# EAGLE schematic BeagleBone_Black_Rev C EAGLE PCB (EAGLE 7.2.0), part 2 of 2
## Sheet 9 of 11
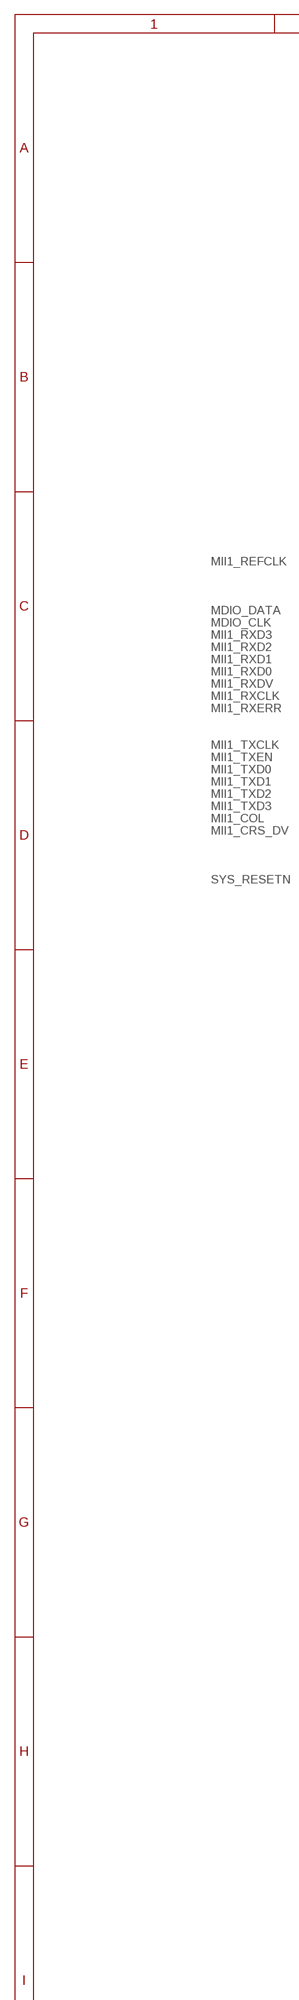
[diagram p14: schematic, sheet 9, part 1 of 2]
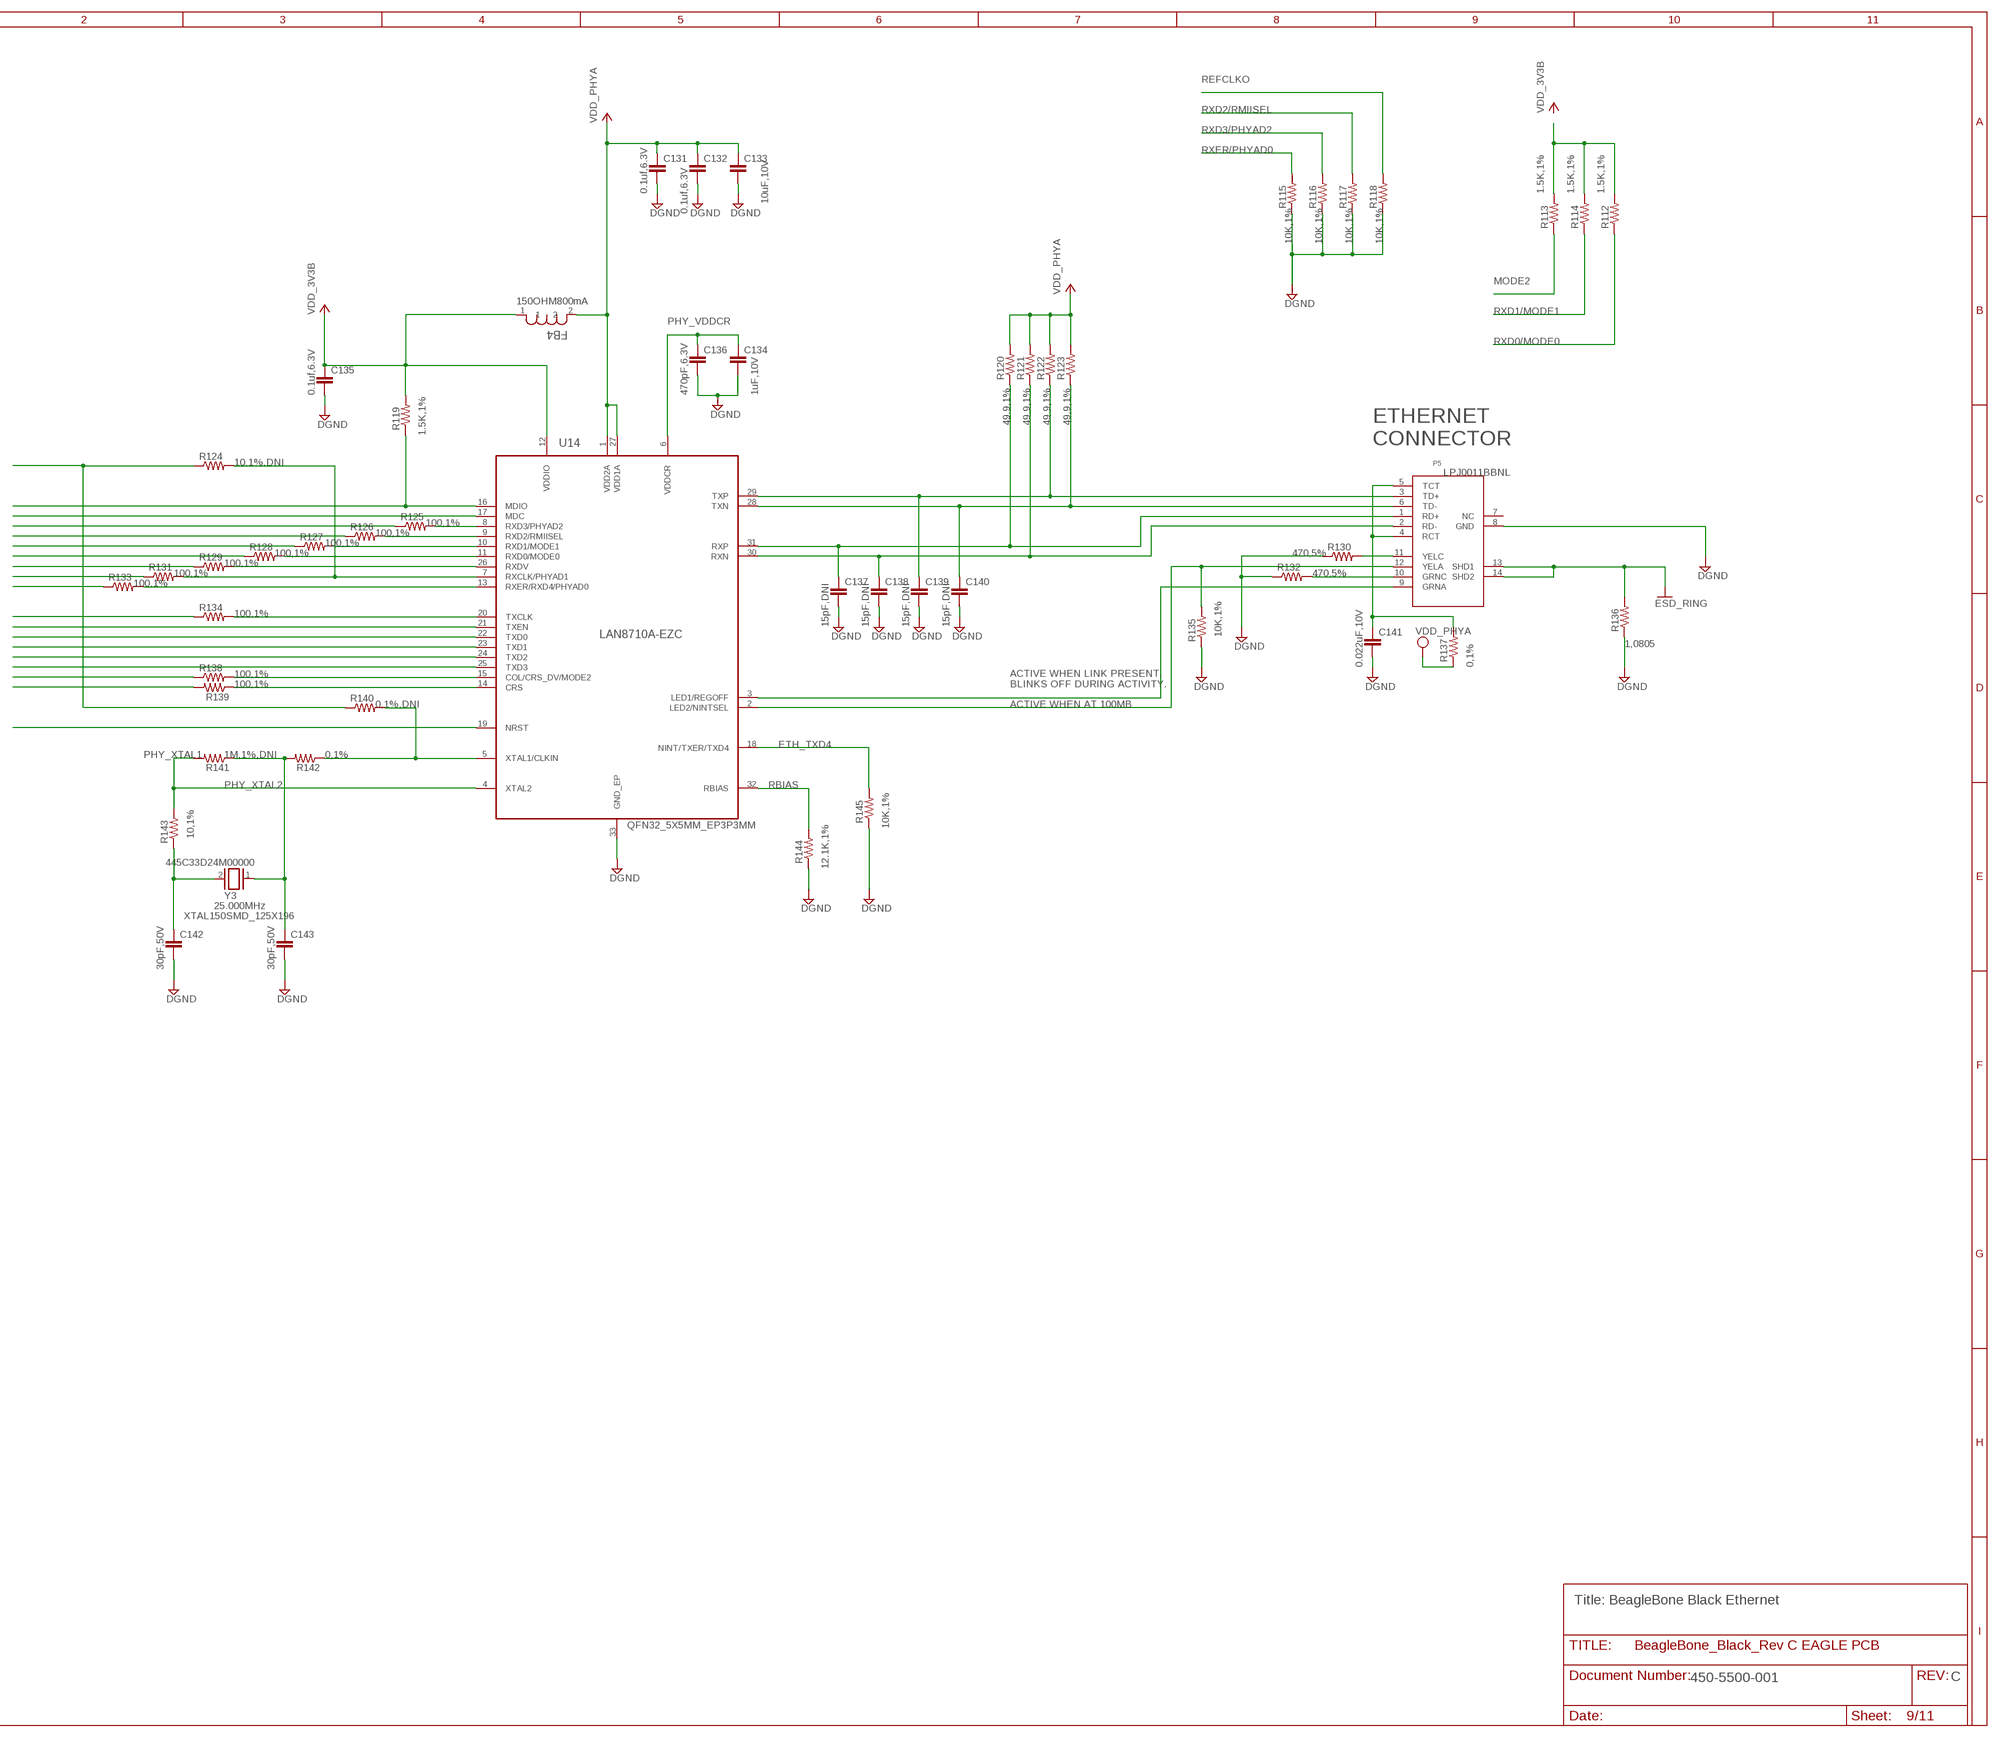
[diagram p15: schematic, sheet 9, part 2 of 2]

### Parts
C131  C-EUC0402  [C0402]
C132  C-EUC0402  [C0402]
C133  C-EUC0402  [C0402]
C134  C-EUC0402  [C0402]
C135  C-EUC0402  [C0402]
C136  C-EUC0402  [C0402]
C137  C-EUC0402  [C0402]
C138  C-EUC0402  [C0402]
C139  C-EUC0402  [C0402]
C140  C-EUC0402  [C0402]
C141  C-EUC0402  [C0402]
C142  C-EUC0402  [C0402]
C143  C-EUC0402  [C0402]
FB4  PM0805-68NK-RC  [INDC2115X15N]
P5  LPJ0011BBNL  [LPJ0011BBNL]
R112  R-US_R0402  [R0402]
R113  R-US_R0402  [R0402]
R114  R-US_R0402  [R0402]
R115  R-US_R0402  [R0402]
R116  R-US_R0402  [R0402]
R117  R-US_R0402  [R0402]
R118  R-US_R0402  [R0402]
R119  R-US_R0402  [R0402]
R120  R-US_R0402  [R0402]
R121  R-US_R0402  [R0402]
R122  R-US_R0402  [R0402]
R123  R-US_R0402  [R0402]
R124  R-US_R0402  [R0402]
R125  R-US_R0402  [R0402]
R126  R-US_R0402  [R0402]
R127  R-US_R0402  [R0402]
R128  R-US_R0402  [R0402]
R129  R-US_R0402  [R0402]
R130  R-US_R0402  [R0402]
R131  R-US_R0402  [R0402]
R132  R-US_R0402  [R0402]
R133  R-US_R0402  [R0402]
R134  R-US_R0402  [R0402]
R135  R-US_R0402  [R0402]
R136  R-US_R0402  [R0402]
R137  R-US_R0402  [R0402]
R138  R-US_R0402  [R0402]
R139  R-US_R0402  [R0402]
R140  R-US_R0402  [R0402]
R141  R-US_R0402  [R0402]
R142  R-US_R0402  [R0402]
R143  R-US_R0402  [R0402]
R144  R-US_R0402  [R0402]
R145  R-US_R0402  [R0402]
U14  LAN8710A-EZC  [QFN50P500X500X100-33N]
Y3  445C33D24M00000  [445C33D24M00000]

### Nets
GND: C131.2 C132.2 C133.2 C134.2 C135.2 C136.2 C137.2 C138.2 C139.2 C140.2 C141.2 C142.2 C143.2 P5.8(GND) P5.13(SHD1) P5.14(SHD2) R115.1 R116.1 R117.1 R118.1 R130.1 R132.1 R135.1 R136.1 R136.2 R144.1 R145.1 U14.33(GND_EP) ; supply symbol labelled DGND, ESD_RING ; also sheet 2,3,4,5,6,7,8,10,11
MDIO_CLK: U14.17(MDC) ; also sheet 4
MDIO_DATA: R119.1 U14.16(MDIO) ; also sheet 4
MII1_COL: R138.1 ; also sheet 4
MII1_CRS_DV: R139.2 ; also sheet 4
MII1_REFCLK: R124.1 R140.1 ; also sheet 4
MII1_RXCLK: R131.1 ; also sheet 4
MII1_RXD0: R128.1 ; also sheet 4
MII1_RXD1: R127.1 ; also sheet 4
MII1_RXD2: R126.1 ; also sheet 4
MII1_RXD3: R125.1 ; also sheet 4
MII1_RXDV: R129.1 ; also sheet 4
MII1_RXERR: R133.1 ; also sheet 4
MII1_TXCLK: R134.1 ; also sheet 4
MII1_TXD0: U14.22(TXD0) ; also sheet 4
MII1_TXD1: U14.23(TXD1) ; also sheet 4
MII1_TXD2: U14.24(TXD2) ; also sheet 4
MII1_TXD3: U14.25(TXD3) ; also sheet 4
MII1_TXEN: U14.21(TXEN) ; also sheet 4
N$292: C142.1 R143.1 Y3.2
N$296: C143.1 R141.1 R142.2 Y3.1
N$299: R140.2 R142.1 U14.5(XTAL1/CLKIN)
N$300: R141.2 R143.2 U14.4(XTAL2)
N$301: R139.1 U14.14(CRS)
N$302: R138.2 U14.15(COL/CRS_DV/MODE2)
N$310: R134.2 U14.20(TXCLK)
N$312: R133.2 U14.13(RXER/RXD4/PHYAD0)
N$315: R124.2 R131.2 U14.7(RXCLK/PHYAD1)
N$316: R129.2 U14.26(RXDV)
N$318: R128.2 U14.11(RXD0/MODE0)
N$320: R127.2 U14.10(RXD1/MODE1)
N$322: R126.2 U14.9(RXD2/RMIISEL)
N$325: R125.2 U14.8(RXD3/PHYAD2)
N$329: C134.1 C136.1 U14.6(VDDCR)
N$330: R144.2 U14.32(RBIAS)
N$331: R145.2 U14.18(NINT/TXER/TXD4)
N$332: C139.1 P5.3(TD+) R122.1 U14.29(TXP)
N$333: C140.1 R123.1 U14.28(TXN)
N$334: C137.1 P5.1(RD+) R120.1 U14.31(RXP)
N$335: C138.1 P5.2(RD-) R121.1 U14.30(RXN)
N$336: R112.2 R113.2 R114.2
N$337: P5.9(GRNA) U14.3(LED1/REGOFF)
N$338: R115.2
N$339: P5.12(YELA) R135.2
N$340: P5.11(YELC) R130.2
N$341: P5.10(GRNC) R132.2
N$342: C141.1 P5.4(RCT) P5.5(TCT) R137.2
N$343: R116.2
N$344: R117.2
N$345: R118.2
N$346: R113.1
N$347: R114.1
N$348: R112.1
SYS_RESETN: U14.19(NRST) ; also sheet 3,11
VCC: C131.1 C132.1 C133.1 C135.1 FB4.1 FB4.2 R119.2 R120.2 R121.2 R122.2 R123.2 R137.1 U14.1(VDD2A) U14.12(VDDIO) U14.27(VDD1A) ; supply symbol labelled VDD_3V3B, VDD_PHYA ; also sheet 2,3,4,5,6,7,8,10,11
Unconnected: P5.6(TD-) P5.7(NC) U14.2(LED2/NINTSEL)

### Notes on the sheet
- REFCLKO
- RXD2/RMIISEL
- RXD3/PHYAD2
- RXER/PHYAD0
- 0.1uf,6.3V | 1.5K,1% | 1.5K,1% | 1.5K,1%
- 10uF,10V
- 0.1uf,6.3V
- 10K,1% | 10K,1% | 10K,1% | 10K,1%
- MODE2
- 150OHM800mA
- RXD1/MODE1
- PHY_VDDCR
- RXD0/MODE0
- 0.1uf,6.3V | 470pF,6.3V | 1uF,10V
- 49.9,1% | 49.9,1% | 49.9,1% | 49.9,1%
- 1.5K,1%
- ETHERNET
  CONNECTOR
- 10,1%,DNI
- LPJ0011BBNL
- 100,1%
- 100,1%
- 100,1%
- 100,1% | 470,5%
- 100,1%
- 100,1% | 470,5%
- 100,1%
- 100,1%
- 15pF,DNI | 15pF,DNI | 15pF,DNI | 15pF,DNI
- 10K,1%
- 1,0805
- 0.022uF,10V | 0,1%
- 100,1%
- 100,1%
- ACTIVE WHEN LINK PRESENT.
  BLINKS OFF DURING ACTIVITY.
- 0,1%,DNI | ACTIVE WHEN AT 100MB
- ETH_TXD4
- PHY_XTAL1 | 1M,1%,DNI | 0,1%
- PHY_XTAL2 | RBIAS
- QFN32_5X5MM_EP3P3MM | 10K,1%
- 10,1%
- 12.1K,1%
- Y3
- 25.000MHz
- XTAL150SMD_125X196
- 30pF,50V | 30pF,50V
- Title: BeagleBone Black Ethernet
- 450-5500-001 | C

## Sheet 10 of 11
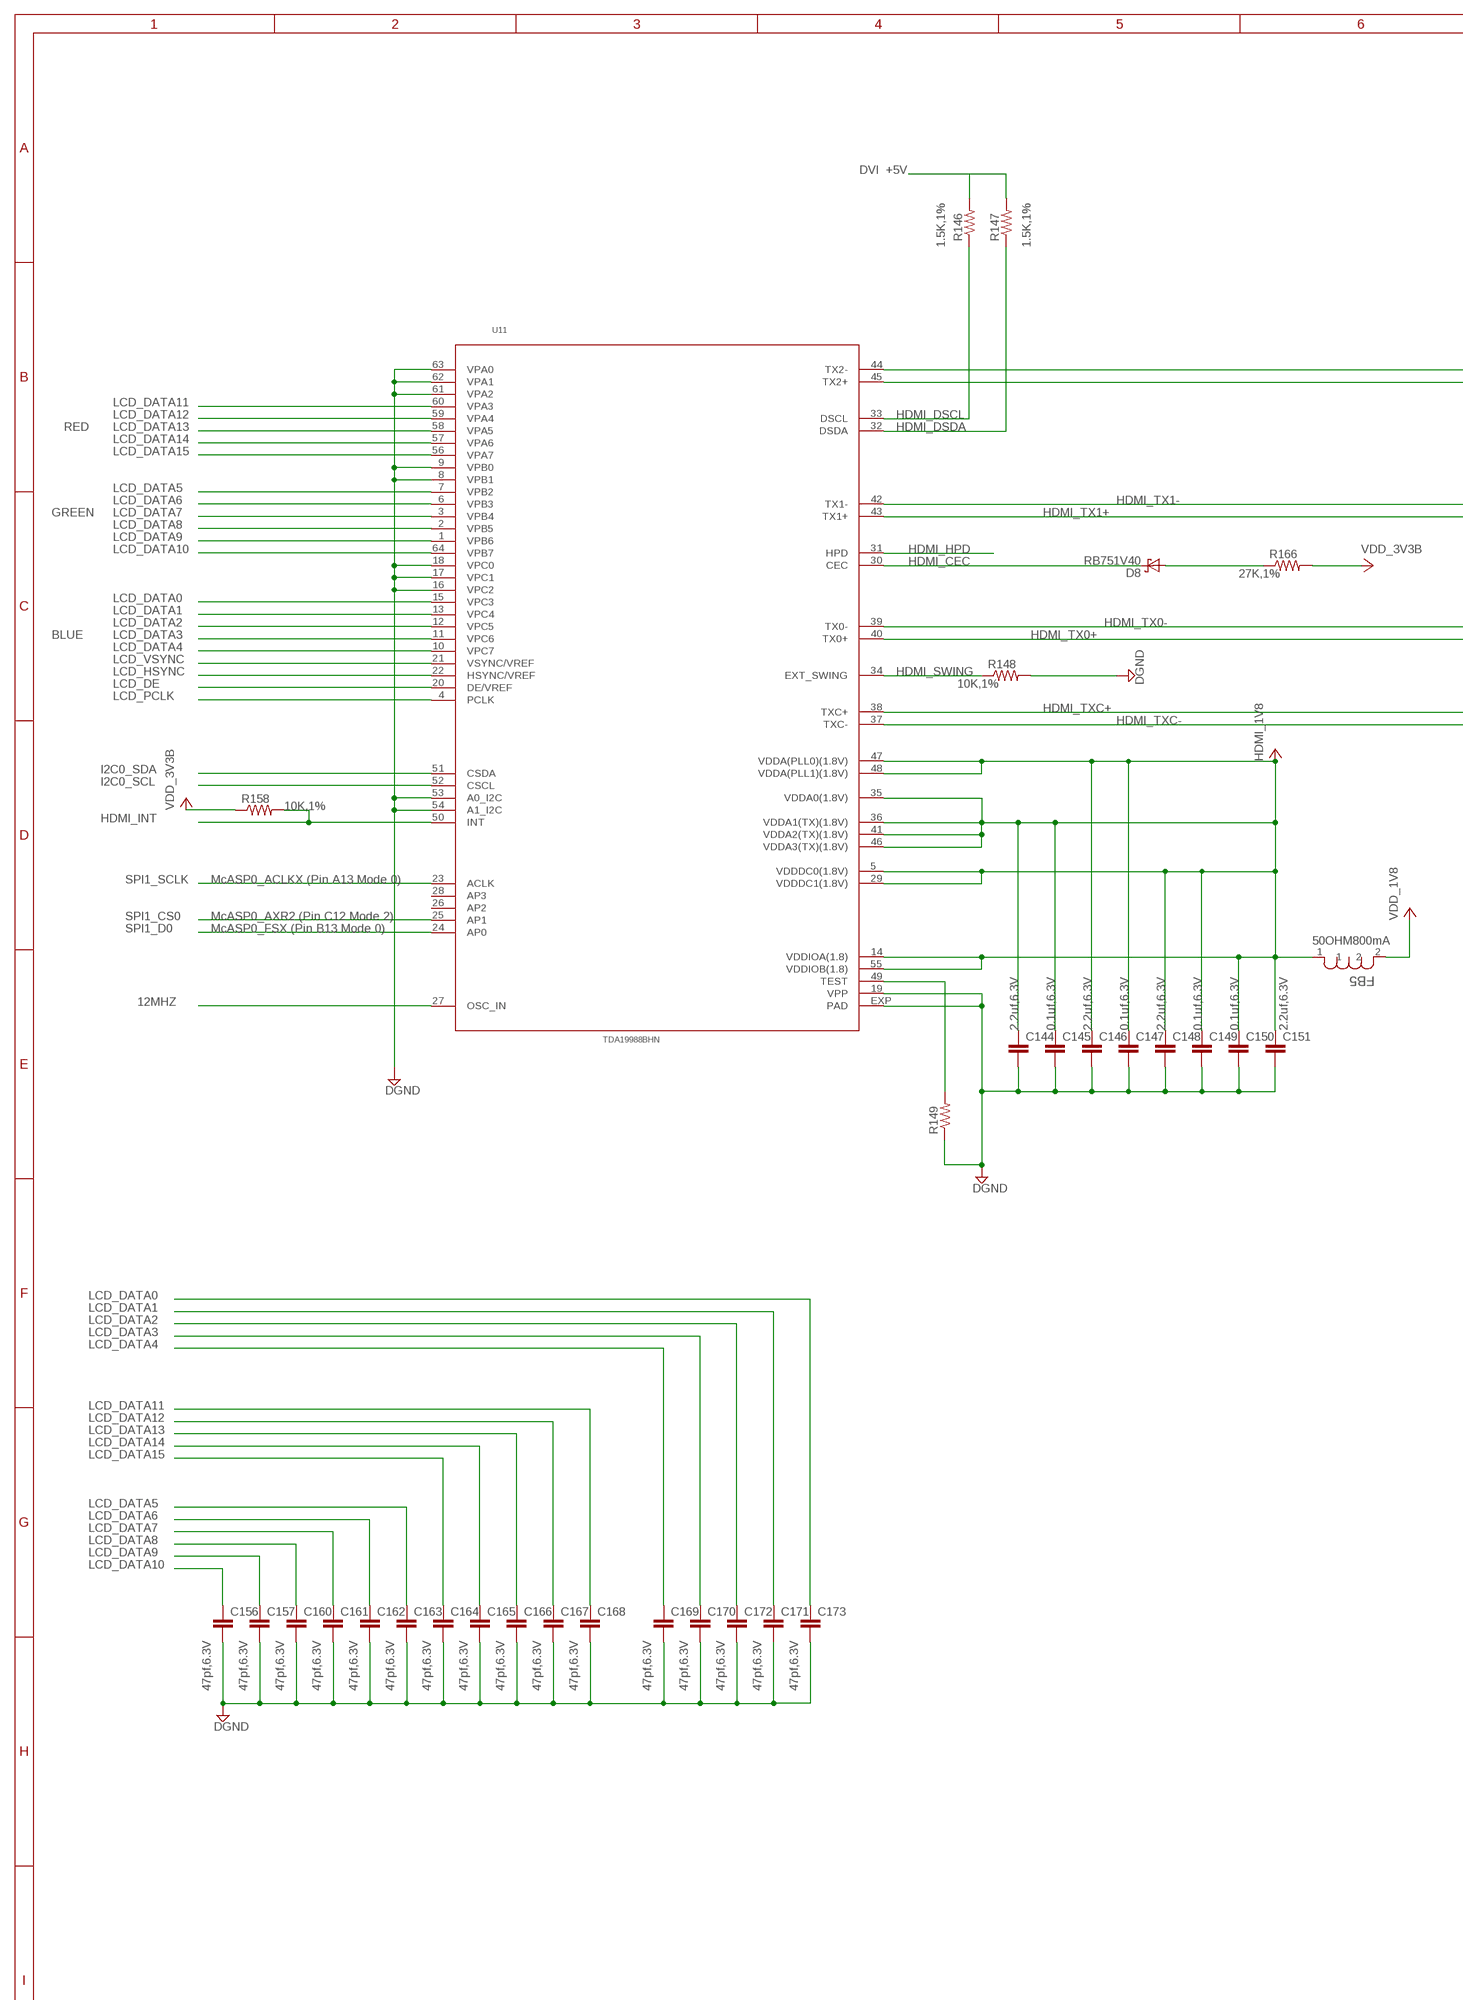
[diagram p16: schematic, sheet 10, part 1 of 2]
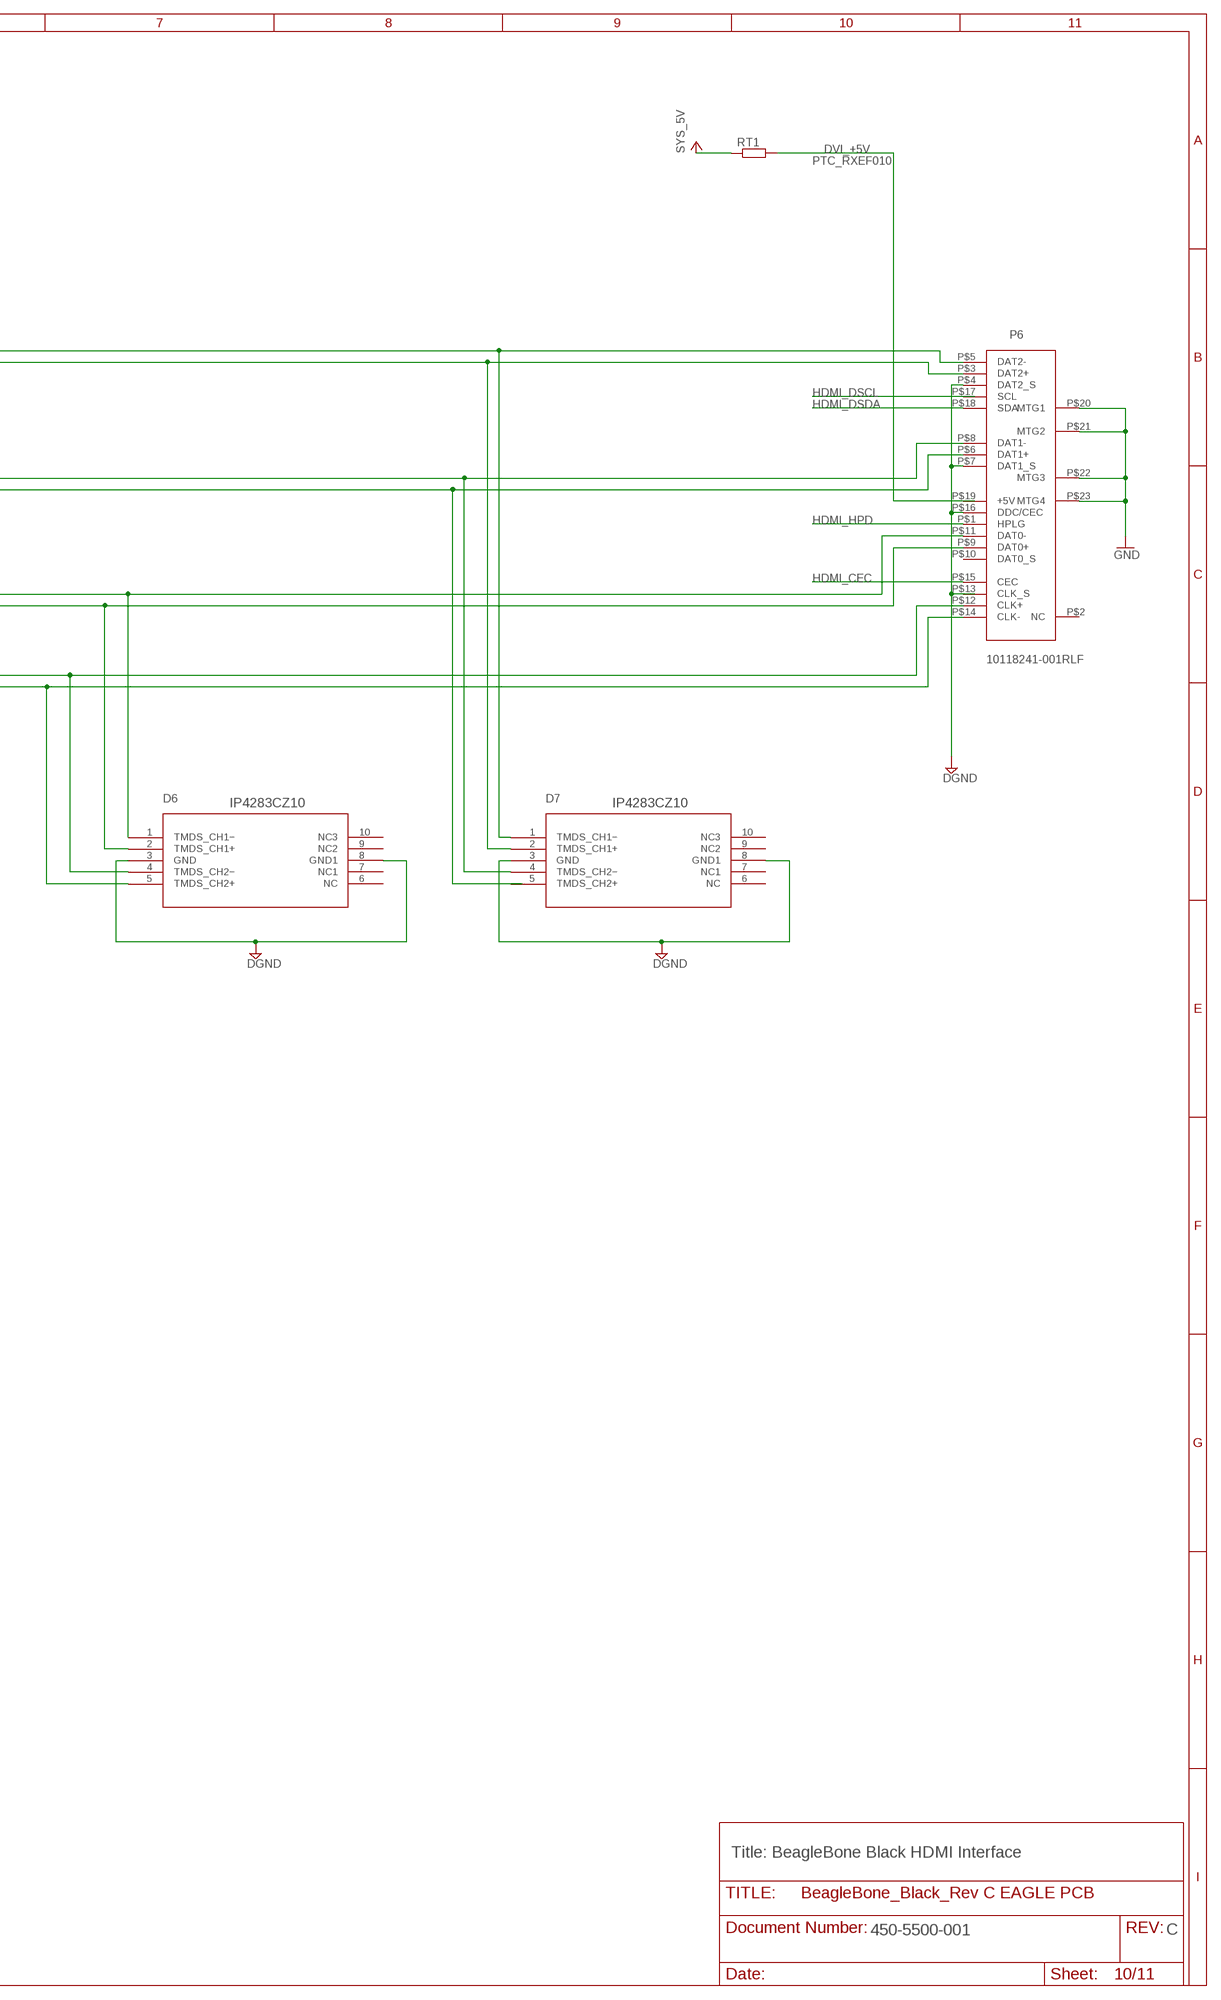
[diagram p17: schematic, sheet 10, part 2 of 2]

### Parts
C144  C-EUC0402  [C0402]
C145  C-EUC0402  [C0402]
C146  C-EUC0402  [C0402]
C147  C-EUC0402  [C0402]
C148  C-EUC0402  [C0402]
C149  C-EUC0402  [C0402]
C150  C-EUC0402  [C0402]
C151  C-EUC0402  [C0402]
C156  C-EUC0402  [C0402]
C157  C-EUC0402  [C0402]
C160  C-EUC0402  [C0402]
C161  C-EUC0402  [C0402]
C162  C-EUC0402  [C0402]
C163  C-EUC0402  [C0402]
C164  C-EUC0402  [C0402]
C165  C-EUC0402  [C0402]
C166  C-EUC0402  [C0402]
C167  C-EUC0402  [C0402]
C168  C-EUC0402  [C0402]
C169  C-EUC0402  [C0402]
C170  C-EUC0402  [C0402]
C171  C-EUC0402  [C0402]
C172  C-EUC0402  [C0402]
C173  C-EUC0402  [C0402]
D6  IP4283CZ10  [IP4283CZ20]
D7  IP4283CZ10  [IP4283CZ20]
D8  RB751V40  [RB751V40]
FB5  PM0805-56NK-RC  [INDC2115X15N]
P6  10118241-001RLF  [10118241-001RLF]
R146  R-US_R0402  [R0402]
R147  R-US_R0402  [R0402]
R148  R-US_R0402  [R0402]
R149  R-US_R0402  [R0402]
R158  R-US_R0402  [R0402]
R166  R-US_R0402  [R0402]
RT1  R-EU_VMTB60  [VMTB60]
U11  TDA19988BHN  [TDA19988BHN]

### Nets
12MHZ: U11.27(OSC_IN) ; also sheet 3
GND: C144.2 C145.2 C146.2 C147.2 C148.2 C149.2 C150.2 C151.2 C156.2 C157.2 C160.2 C161.2 C162.2 C163.2 C164.2 C165.2 C166.2 C167.2 C168.2 C169.2 C170.2 C171.2 C172.2 C173.2 D6.3(GND) D6.8(GND1) D7.3(GND) D7.8(GND1) P6.P$4(DAT2_S) P6.P$7(DAT1_S) P6.P$16(DDC/CEC) P6.P$20(MTG1) P6.P$21(MTG2) P6.P$22(MTG3) P6.P$23(MTG4) R148.2 R149.1 U11.8(VPB1) U11.9(VPB0) U11.16(VPC2) U11.17(VPC1) U11.18(VPC0) U11.19(VPP) U11.53(A0_I2C) U11.54(A1_I2C) U11.61(VPA2) U11.62(VPA1) U11.63(VPA0) U11.EXP(PAD) ; supply symbol labelled DGND ; also sheet 2,3,4,5,6,7,8,9,11
HDMI_INT: R158.2 U11.50(INT) ; also sheet 3
I2C0_SCL: U11.52(CSCL) ; also sheet 2,4,11
I2C0_SDA: U11.51(CSDA) ; also sheet 2,4,11
LCD_DATA0: C173.1 U11.15(VPC3) ; also sheet 4,6,11
LCD_DATA1: C171.1 U11.13(VPC4) ; also sheet 4,6,11
LCD_DATA2: C172.1 U11.12(VPC5) ; also sheet 4,6,11
LCD_DATA3: C170.1 U11.11(VPC6) ; also sheet 4,6,11
LCD_DATA4: C169.1 U11.10(VPC7) ; also sheet 4,6,11
LCD_DATA5: C163.1 U11.7(VPB2) ; also sheet 4,6,11
LCD_DATA6: C162.1 U11.6(VPB3) ; also sheet 4,6,11
LCD_DATA7: C161.1 U11.3(VPB4) ; also sheet 4,6,11
LCD_DATA8: C160.1 U11.2(VPB5) ; also sheet 4,6,11
LCD_DATA9: C157.1 U11.1(VPB6) ; also sheet 4,6,11
LCD_DATA10: C156.1 U11.64(VPB7) ; also sheet 4,6,11
LCD_DATA11: C168.1 U11.60(VPA3) ; also sheet 4,6,11
LCD_DATA12: C167.1 U11.59(VPA4) ; also sheet 4,6,11
LCD_DATA13: C166.1 U11.58(VPA5) ; also sheet 4,6,11
LCD_DATA14: C165.1 U11.57(VPA6) ; also sheet 4,6,11
LCD_DATA15: C164.1 U11.56(VPA7) ; also sheet 4,6,11
LCD_DE: U11.20(DE/VREF) ; also sheet 4,11
LCD_HSYNC: U11.22(HSYNC/VREF) ; also sheet 4,11
LCD_PCLK: U11.4(PCLK) ; also sheet 4,11
LCD_VSYNC: U11.21(VSYNC/VREF) ; also sheet 4,11
N$4: D8.A R166.1
N$392: R149.2 U11.49(TEST)
N$393: D6.5(TMDS_CH2+) P6.P$14(CLK-) U11.37(TXC-)
N$394: D6.4(TMDS_CH2−) P6.P$12(CLK+) U11.38(TXC+)
N$395: D6.1(TMDS_CH1−) P6.P$11(DAT0-) U11.39(TX0-)
N$396: D6.2(TMDS_CH1+) P6.P$9(DAT0+) U11.40(TX0+)
N$397: D7.4(TMDS_CH2−) P6.P$8(DAT1-) U11.42(TX1-)
N$398: P6.P$6(DAT1+) U11.43(TX1+)
N$399: D7.1(TMDS_CH1−) P6.P$5(DAT2-) U11.44(TX2-)
N$400: D7.2(TMDS_CH1+) P6.P$3(DAT2+) U11.45(TX2+)
N$402: P6.P$18(SDA)
N$403: P6.P$1(HPLG)
N$404: P6.P$15(CEC)
N$405: R146.1 U11.33(DSCL)
N$406: RT1.2
N$407: R147.1 U11.32(DSDA)
N$408: R146.2 R147.2
N$409: U11.31(HPD)
N$410: D8.C(K) U11.30(CEC)
N$411: R148.1 U11.34(EXT_SWING)
SPI1_CS0: U11.25(AP1) ; also sheet 4,11
SPI1_D0: U11.24(AP0) ; also sheet 4,11
SPI1_SCLK: U11.23(ACLK) ; also sheet 4,11
VCC: C144.1 C145.1 C146.1 C147.1 C148.1 C149.1 C150.1 C151.1 FB5.1 FB5.2 R158.1 R166.2 RT1.1 U11.5(VDDDC0(1.8V)) U11.14(VDDIOA(1.8)) U11.29(VDDDC1(1.8V)) U11.35(VDDA0(1.8V)) U11.36(VDDA1(TX)(1.8V)) U11.41(VDDA2(TX)(1.8V)) U11.46(VDDA3(TX)(1.8V)) U11.47(VDDA(PLL0)(1.8V)) U11.48(VDDA(PLL1)(1.8V)) U11.55(VDDIOB(1.8)) ; supply symbol labelled VDD_3V3B, VDD_1V8, HDMI_1V8, SYS_5V ; also sheet 2,3,4,5,6,7,8,9,11
Unconnected: D6.6(NC) D6.7(NC1) D6.9(NC2) D7.5(TMDS_CH2+) D7.6(NC) D7.7(NC1) D7.9(NC2) P6.P$2(NC) P6.P$10(DAT0_S) P6.P$13(CLK_S) P6.P$17(SCL) P6.P$19(+5V) U11.26(AP2) U11.28(AP3)

### Notes on the sheet
- DVI_+5V
- DVI  +5V | PTC_RXEF010
- 1.5K,1% | 1.5K,1%
- P6
- HDMI_DSCL | HDMI_DSCL
- RED | HDMI_DSDA | HDMI_DSDA
- HDMI_TX1-
- GREEN | HDMI_TX1+
- HDMI_HPD | HDMI_HPD
- HDMI_CEC
- 27K,1%
- HDMI_CEC
- HDMI_TX0-
- BLUE | HDMI_TX0+
- HDMI_SWING
- 10K,1%
- 10118241-001RLF
- HDMI_TXC+
- HDMI_TXC-
- 10K,1%
- D6 | D7
- McASP0_ACLKX (Pin A13 Mode 0)
- McASP0_AXR2 (Pin C12 Mode 2)
- McASP0_FSX (Pin B13 Mode 0)
- 50OHM800mA
- 2.2uf,6.3V | 0.1uf,6.3V | 2.2uf,6.3V | 0.1uf,6.3V | 2.2uf,6.3V | 0.1uf,6.3V | 0.1uf,6.3V | 2.2uf,6.3V
- 47pf,6.3V | 47pf,6.3V | 47pf,6.3V | 47pf,6.3V | 47pf,6.3V | 47pf,6.3V | 47pf,6.3V | 47pf,6.3V | 47pf,6.3V | 47pf,6.3V | 47pf,6.3V | 47pf,6.3V | 47pf,6.3V | 47pf,6.3V | 47pf,6.3V | 47pf,6.3V
- Title: BeagleBone Black HDMI Interface
- 450-5500-001 | C

## Sheet 11 of 11
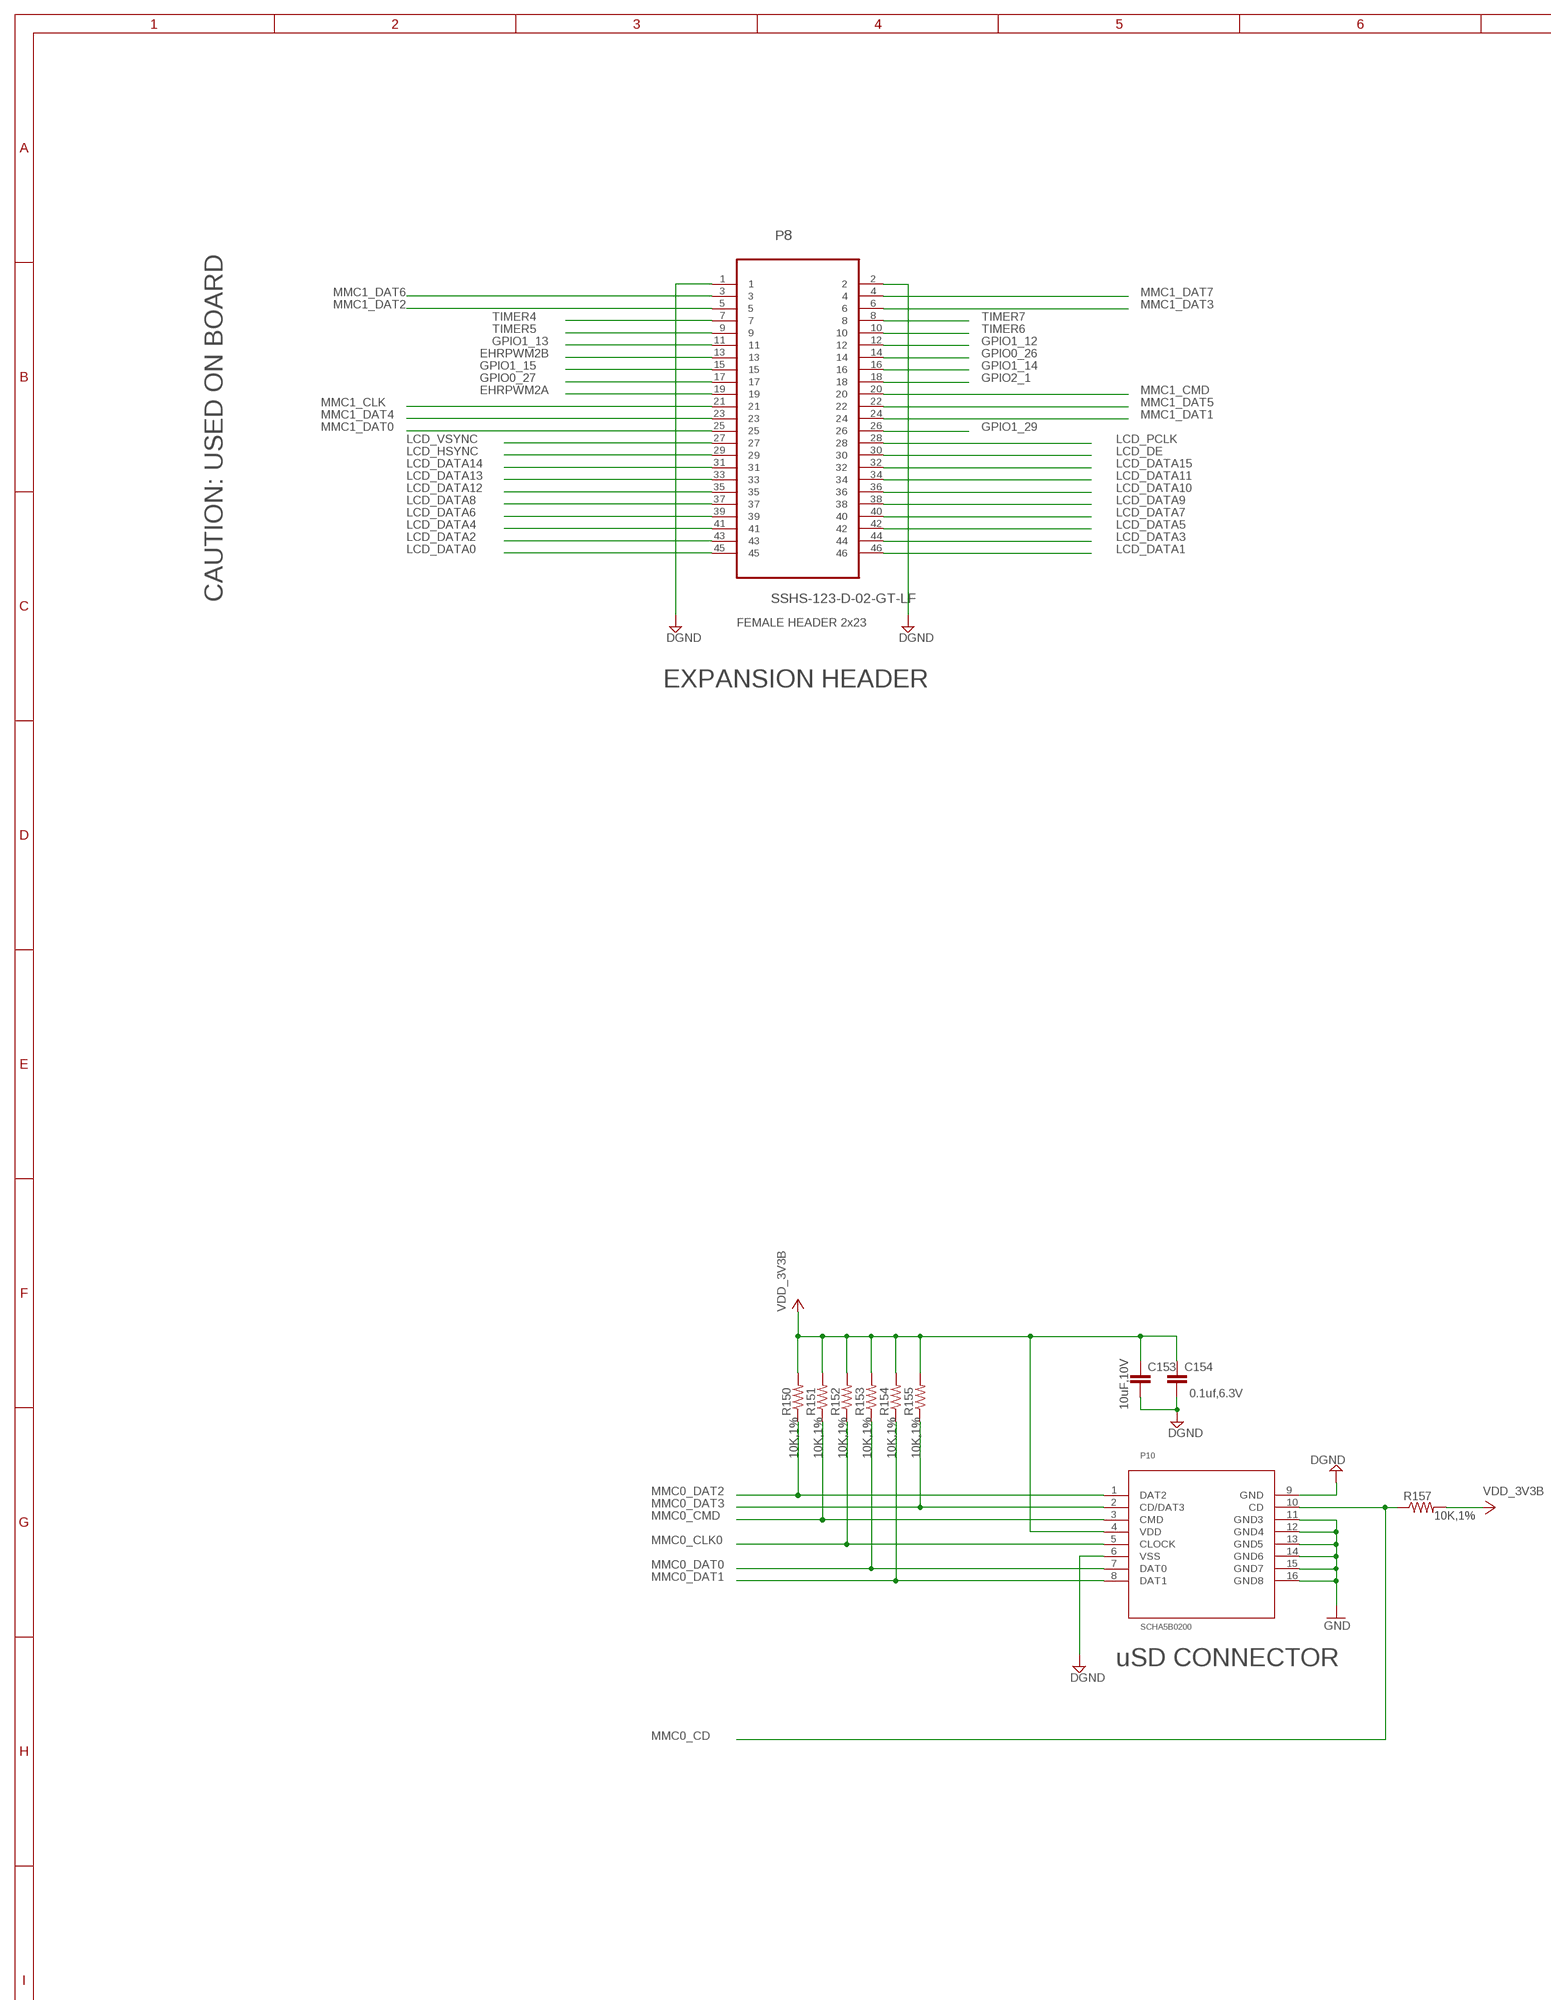
[diagram p18: schematic, sheet 11, part 1 of 2]
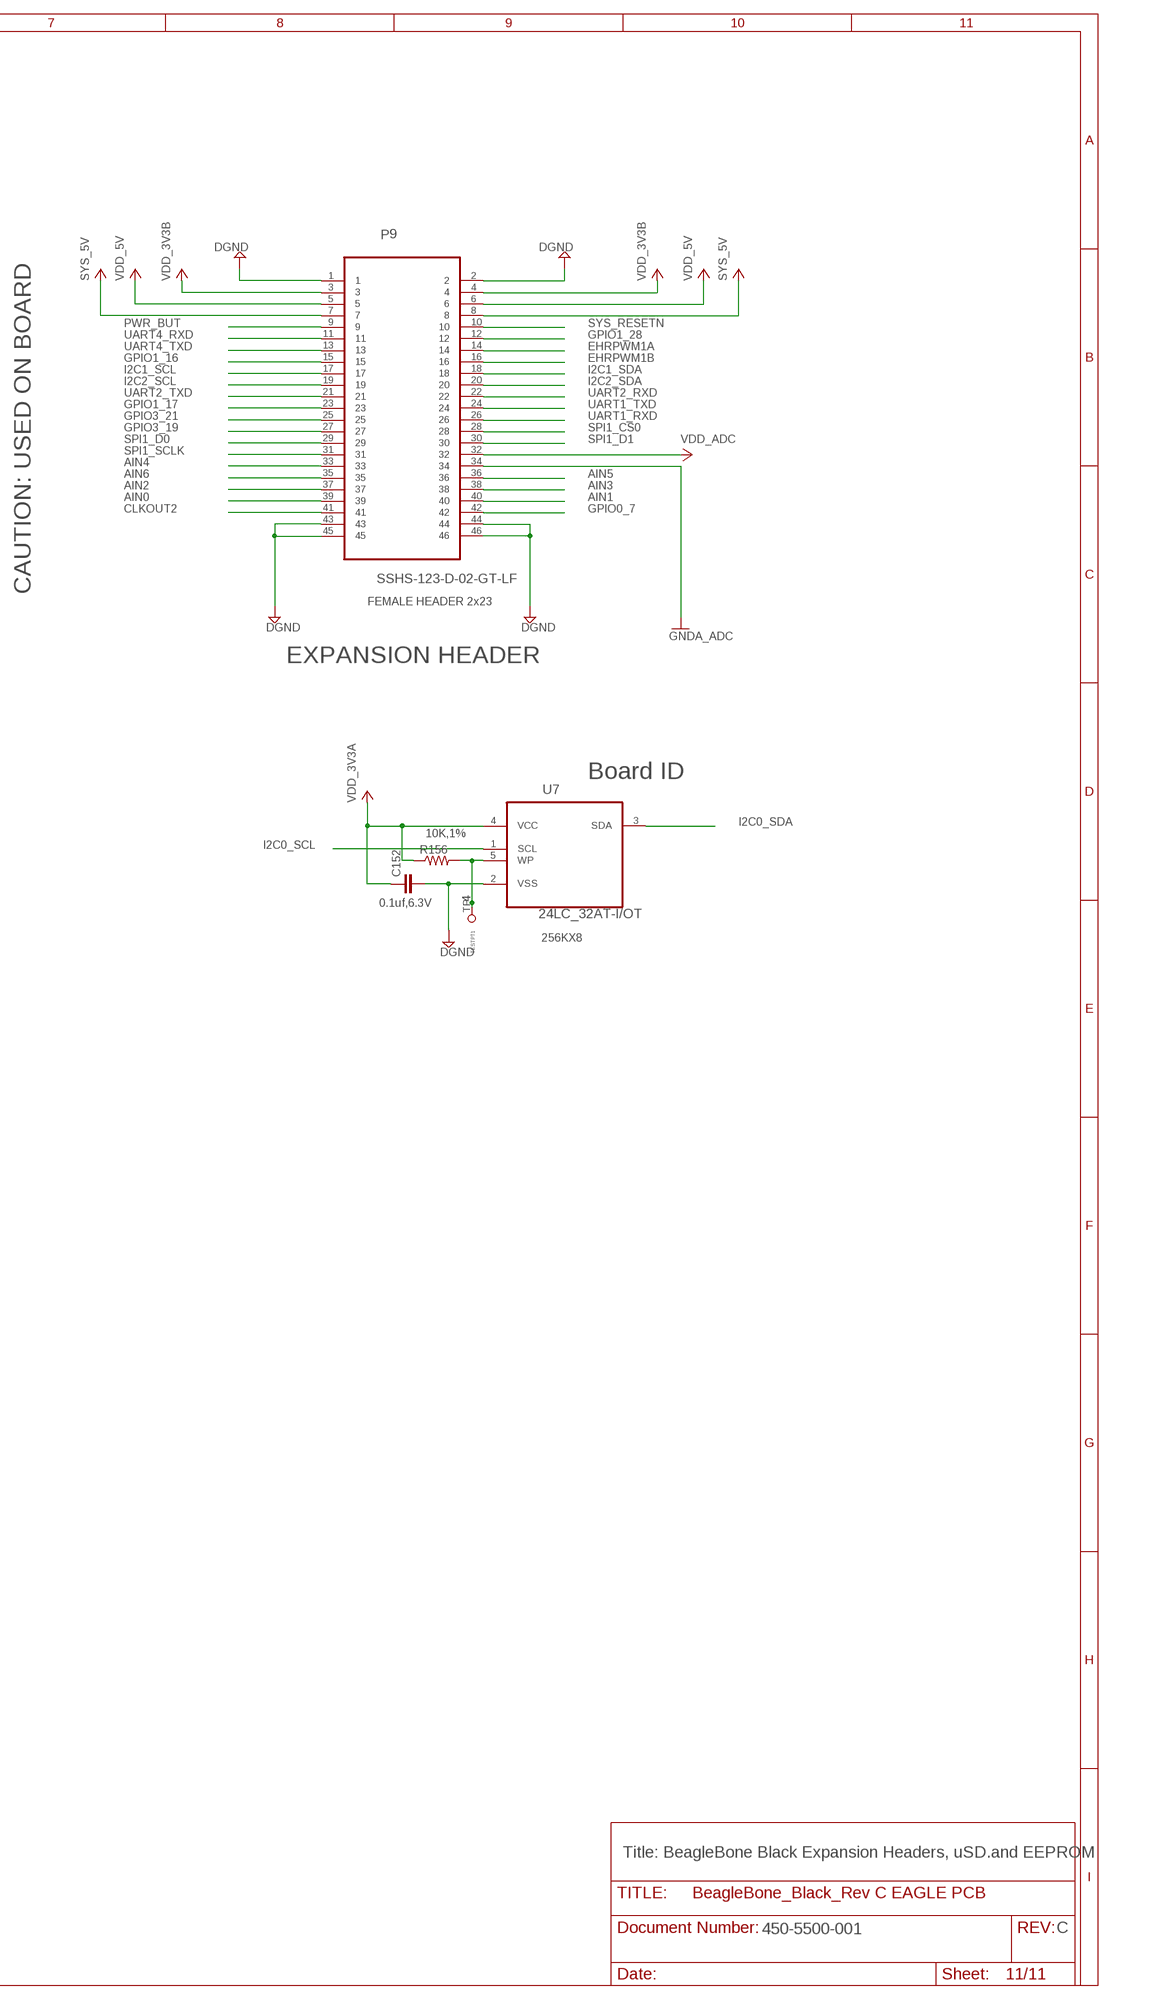
[diagram p19: schematic, sheet 11, part 2 of 2]

### Parts
C152  C-EUC0402  [C0402]
C153  C-EUC0402  [C0402]
C154  C-EUC0402  [C0402]
P8  SSHS-123-D-02-GT-LF  [SSHS-123-D-02-GT-LF]
P10  SCHA5B0200  [SCHA5B0200]
R150  R-US_R0402  [R0402]
R151  R-US_R0402  [R0402]
R152  R-US_R0402  [R0402]
R153  R-US_R0402  [R0402]
R154  R-US_R0402  [R0402]
R155  R-US_R0402  [R0402]
R156  R-US_R0402  [R0402]
R157  R-US_R0402  [R0402]
TP4  TESTPOINT  [TESTPOINT]
U7  24LC_32AT-I/OT  [SOT95P290X145-5N]
U$2  SSHS-123-D-02-GT-LF  [SSHS-123-D-02-GT-LF]

### Nets
AIN0: U$2.39 ; also sheet 4
AIN1: U$2.40 ; also sheet 4
AIN2: U$2.37 ; also sheet 4
AIN3: U$2.38 ; also sheet 4
AIN4: U$2.33 ; also sheet 4
AIN5: U$2.36 ; also sheet 4
AIN6: U$2.35 ; also sheet 4
CLKOUT2: U$2.41 ; also sheet 3
EHRPWM1A: U$2.14 ; also sheet 3
EHRPWM1B: U$2.16 ; also sheet 3
EHRPWM2A: P8.19 ; also sheet 3
EHRPWM2B: P8.13 ; also sheet 3
GND: C152.2 C153.2 C154.2 P8.1 P8.2 P10.6(VSS) P10.9(GND) P10.11(GND3) P10.12(GND4) P10.13(GND5) P10.14(GND6) P10.15(GND7) P10.16(GND8) U7.2(VSS) U$2.1 U$2.2 U$2.34 U$2.43 U$2.44 U$2.45 U$2.46 ; supply symbol labelled DGND, GNDA_ADC ; also sheet 2,3,4,5,6,7,8,9,10
GPIO0_7: U$2.42 ; also sheet 4
GPIO0_26: P8.14 ; also sheet 3
GPIO0_27: P8.17 ; also sheet 3
GPIO1_12: P8.12 ; also sheet 3
GPIO1_13: P8.11 ; also sheet 3
GPIO1_14: P8.16 ; also sheet 3
GPIO1_15: P8.15 ; also sheet 3
GPIO1_16: U$2.15 ; also sheet 3
GPIO1_17: U$2.23 ; also sheet 3
GPIO1_28: U$2.12 ; also sheet 3
GPIO1_29: P8.26 ; also sheet 3
GPIO2_1: P8.18 ; also sheet 3
GPIO3_19: U$2.27 ; also sheet 4
GPIO3_21: U$2.25 ; also sheet 3,4
I2C0_SCL: U7.1(SCL) ; also sheet 2,4,10
I2C0_SDA: U7.3(SDA) ; also sheet 2,4,10
I2C1_SCL: U$2.17 ; also sheet 4
I2C1_SDA: U$2.18 ; also sheet 4
I2C2_SCL: U$2.19 ; also sheet 4
I2C2_SDA: U$2.20 ; also sheet 4
LCD_DATA0: P8.45 ; also sheet 4,6,10
LCD_DATA1: P8.46 ; also sheet 4,6,10
LCD_DATA2: P8.43 ; also sheet 4,6,10
LCD_DATA3: P8.44 ; also sheet 4,6,10
LCD_DATA4: P8.41 ; also sheet 4,6,10
LCD_DATA5: P8.42 ; also sheet 4,6,10
LCD_DATA6: P8.39 ; also sheet 4,6,10
LCD_DATA7: P8.40 ; also sheet 4,6,10
LCD_DATA8: P8.37 ; also sheet 4,6,10
LCD_DATA9: P8.38 ; also sheet 4,6,10
LCD_DATA10: P8.36 ; also sheet 4,6,10
LCD_DATA11: P8.34 ; also sheet 4,6,10
LCD_DATA12: P8.35 ; also sheet 4,6,10
LCD_DATA13: P8.33 ; also sheet 4,6,10
LCD_DATA14: P8.31 ; also sheet 4,6,10
LCD_DATA15: P8.32 ; also sheet 4,6,10
LCD_DE: P8.30 ; also sheet 4,10
LCD_HSYNC: P8.29 ; also sheet 4,10
LCD_PCLK: P8.28 ; also sheet 4,10
LCD_VSYNC: P8.27 ; also sheet 4,10
MMC0_CD: P10.10(CD) R157.1 ; also sheet 3,4
MMC0_CLK0: P10.5(CLOCK) R152.1
MMC0_CMD: P10.3(CMD) R151.1 ; also sheet 3
MMC0_DAT0: P10.7(DAT0) R153.1 ; also sheet 3
MMC0_DAT1: P10.8(DAT1) R154.1 ; also sheet 3
MMC0_DAT2: P10.1(DAT2) R150.1 ; also sheet 3
MMC0_DAT3: P10.2(CD/DAT3) R155.1 ; also sheet 3
MMC1_CLK: P8.21 ; also sheet 3,8
MMC1_CMD: P8.20 ; also sheet 3,8
MMC1_DAT0: P8.25 ; also sheet 3,8
MMC1_DAT1: P8.24 ; also sheet 3,8
MMC1_DAT2: P8.5 ; also sheet 3,8
MMC1_DAT3: P8.6 ; also sheet 3,8
MMC1_DAT4: P8.23 ; also sheet 3,8
MMC1_DAT5: P8.22 ; also sheet 3,8
MMC1_DAT6: P8.3 ; also sheet 3,8
MMC1_DAT7: P8.4 ; also sheet 3,8
N$461: R156.2 TP4.TP U7.5(WP)
PWR_BUT: U$2.9 ; also sheet 2
SPI1_CS0: U$2.28 ; also sheet 4,10
SPI1_D0: U$2.29 ; also sheet 4,10
SPI1_D1: U$2.30 ; also sheet 4
SPI1_SCLK: U$2.31 ; also sheet 4,10
SYS_RESETN: U$2.10 ; also sheet 3,9
TIMER4: P8.7 ; also sheet 3
TIMER5: P8.9 ; also sheet 3
TIMER6: P8.10
TIMER7: P8.8 ; also sheet 3
UART1_RXD: U$2.26 ; also sheet 4
UART1_TXD: U$2.24 ; also sheet 4
UART2_RXD: U$2.22 ; also sheet 4
UART2_TXD: U$2.21 ; also sheet 4
UART4_RXD: U$2.11 ; also sheet 3
UART4_TXD: U$2.13 ; also sheet 3
VCC: C152.1 C153.1 C154.1 P10.4(VDD) R150.2 R151.2 R152.2 R153.2 R154.2 R155.2 R156.1 R157.2 U7.4(VCC) U$2.3 U$2.4 U$2.5 U$2.6 U$2.7 U$2.8 U$2.32 ; supply symbol labelled VDD_3V3A, VDD_3V3B, VDD_5V, SYS_5V, VDD_ADC ; also sheet 2,3,4,5,6,7,8,9,10

### Notes on the sheet
- 8
- 9
- GPIO1_29
- CAUTION: USED ON BOARD
- FEMALE HEADER 2x23 | CAUTION: USED ON BOARD
- FEMALE HEADER 2x23
- EXPANSION HEADER
- EXPANSION HEADER
- Board ID
- 10K,1%
- 4
- 0.1uf,6.3V
- 256KX8
- 0.1uf,6.3V
- 10uF,10V
- 10K,1% | 10K,1% | 10K,1% | 10K,1% | 10K,1% | 10K,1%
- 10K,1%
- uSD CONNECTOR
- Title: BeagleBone Black Expansion Headers, uSD.and EEPROM
- 450-5500-001 | C

## Power pins joined to a net without a drawn wire
NC3: D6.10(NC3) D7.10(NC3)

## Library data of the parts
108 C37-C107 C109-C154 C156 C157 C160-C173 = rcl:C-EU: CAPACITOR, European symbol
C1-C4 C7-C22 C24A C25A C26-C30 C158 C159 = eagle-ltspice:C: CAPACITOR, European symbol; SPICEMODEL: NONE; SPICEPREFIX: C
C31-C33 C35 C36 C155 = resistor:C-EU: CAPACITOR, European symbol
C34 = AVE107M06D16T-F:AVE107M06D16T-F
D1-D5 = led:LED: LED OSRAM: - CHIPLED LG R971, LG N971, LY N971, LG Q971, LY Q971, LO R971, LY R971 LH N974, LH R974 LS Q976, LO Q976, LY Q976 LO Q996 - Hyper CHIPLED LW Q18S LB Q993, LB Q99A, LB R99A - SideLED LS A670, LO A670, LY A670, LG A670, LP A670 LB A673, LV A673, LT A673, LW A673 LH A674 LY A675 LS A676, LA A676, LO A676, LY A676, LW A676 LS A679, LY A679, LG A679 - Hyper Micro SIDELED® LS Y876, LA Y876, LO Y876, LY Y876 LT Y87S - SmartLED LW L88C, LW L88S LB L89C, LB L89S, LG L890 LS L89K, LO L89K, LY L89K LS L896, LA L896, LO L896, LY L896 - TOPLED LS T670, LO T670, LY T670, LG T670, LP T670 LSG T670, LSP T670, LSY T670, LOP T670, LYG T670 LG T671, LOG T671, LSG T671 LB T673, LV T673, LT T673, LW T673 LH T674 LS T676, LA T676, LO T676, LY T676, LB T676, LH T676, LSB T676, LW T676 LB T67C, LV T67C, LT T67C, LS T67K, LO T67K, LY T67K, LW E67C LS E67B, LA E67B, LO E67B, LY E67B, LB E67C, LV E67C, LT E67C LW T67C LS T679, LY T679, LG T679 LS T770, LO T770, LY T770, LG T770, LP T770 LB T773, LV T773, LT T773, LW T773 LH T774 LS E675, LA E675, LY E675, LS T675 LS T776, LA T776, LO T776, LY T776, LB T776 LHGB T686 LT T68C, LB T68C - Hyper Mini TOPLED® LB M676 - Mini TOPLED Santana® LG M470 LS M47K, LO M47K, LY M47K Source: http://www.osram.convergy.de LUXEON: - LUMILED® LXK2-PW12-R00, LXK2-PW12-S00, LXK2-PW14-U00, LXK2-PW14-V00 LXK2-PM12-R00, LXK2-PM12-S00, LXK2-PM14-U00 LXK2-PE12-Q00, LXK2-PE12-R00, LXK2-PE12-S00, LXK2-PE14-T00, LXK2-PE14-U00 LXK2-PB12-K00, LXK2-PB12-L00, LXK2-PB12-M00, LXK2-PB14-N00, LXK2-PB14-P00, LXK2-PB14-Q00 LXK2-PR12-L00, LXK2-PR12-M00, LXK2-PR14-Q00, LXK2-PR14-R00 LXK2-PD12-Q00, LXK2-PD12-R00, LXK2-PD12-S00 LXK2-PH12-R00, LXK2-PH12-S00 LXK2-PL12-P00, LXK2-PL12-Q00, LXK2-PL12-R00 Source: www.luxeon.com KINGBRIGHT: KA-3528ASYC Source: www.kingbright.com
D6 D7 = IP4283CZ10:IP4283CZ10
D8 = RB751V40:RB751V40
FB1-FB3 FB7 FB8 = Bourns_By_element14_Batch_1:PM0805-R10K-RC: CHIP INDUCTOR, 100NH, 400mA, 10%, 1.2GHZ; MPN: PM0805-R10K-RC; OC_FARNELL: -; OC_NEWARK: 63K3004; SUPPLIER: BOURNS; TOLERANCE: ±10 %; VALUE: 100 nH
FB4 = Bourns_By_element14_Batch_1:PM0805-68NK-RC: CHIP INDUCTOR, 68NH, 500mA, 10%, 1.45GHZ; MPN: PM0805-68NK-RC; OC_FARNELL: 1180402; OC_NEWARK: 63K3026; SUPPLIER: BOURNS; TOLERANCE: ±10 %; VALUE: 68 nH
FB5 = Bourns_By_element14_Batch_1:PM0805-56NK-RC: CHIP INDUCTOR, 56NH, 500mA, 10%, 1.55GHZ; MPN: PM0805-56NK-RC; OC_FARNELL: -; OC_NEWARK: 63K3024; SUPPLIER: BOURNS; TOLERANCE: ±10 %; VALUE: 56 nH
J1 = 68000-406HLF:68000-406HLF
L1-L3 = LQM2HPN2RMG0L:LQM2HPN2RMG0L
P2 = CTIJTAG:CTIJTAG
P3 = 87520-0010BLF:87520-0010BLF
P4 = UX60SC-MB-5ST(80):UX60SC-MB-5ST(80)
P5 = LPJ0011BBNL:LPJ0011BBNL
P6 = 10118241-001RLF:10118241-001RLF
P8 U$2 = SSHS-123-D-02-GT-LF Beagle:SSHS-123-D-02-GT-LF
P10 = SCHA5B0200:SCHA5B0200
R1 R3-R5 R6A R7 R8 R10-R12 R14A R17-R26 R27A R28-R30 R45-R53 R55-R111 R146-R149 R158-R167 = rcl:R-US_: RESISTOR, American symbol
R54 R112-R145 R150-R157 = resistor:R-US_: RESISTOR, American symbol
RT1 = rcl:R-EU_: RESISTOR, European symbol
S1-S3 = KMR231GLFS:KMR231GLFS
TP2-TP8 TP12 = TESTPOINT:TESTPOINT
U3 = SN74LVC1G06:SN74LVC1G06_DCK_5; DATASHEETURL: http://www.ti.com/lit/gpn/SN74LVC1G06; DESCRIPTION: Single Inverter Buffer/Driver With Open-Drain Output; FAMILY_NAME: LL INVERTING BUFFER AND DRIVER; GENERIC_PART_NUMBER: SN74LVC1G06; INDUSTRY_STD_PKG_TYPE: SC70; MANUFACTURER: Texas Instruments; MANUFACTURER_PART_NUMBER: sn74lvc1g06_dck_5; PACKAGE_DESIGNATOR: DCK; PIN_COUNT: 5; VENDOR: Texas Instruments
U4 = TL5209:TL5209
U5 = AM3358BZCZ:AM3358_BZCZ_324
U6 = SN74LVC1G74:SN74LVC1G74_DCT_8; DATASHEETURL: http://www.ti.com/lit/gpn/SN74LVC1G74; DESCRIPTION: Single Positive-Edge-Triggered D-Type Flip-Flop With Clear and Preset; FAMILY_NAME: LL FLIP-FLOP; GENERIC_PART_NUMBER: SN74LVC1G74; INDUSTRY_STD_PKG_TYPE: SM8; MANUFACTURER: Texas Instruments; MANUFACTURER_PART_NUMBER: sn74lvc1g74_dct_8; PACKAGE_DESIGNATOR: DCT; PIN_COUNT: 8; VENDOR: Texas Instruments
U7 = Microchip-24LCxxx:24LC_: IC, I2C Serial EEPROM,SOT-23-5; MPN: 24LC32AT-I/OT; OC_FARNELL: 1700993; OC_NEWARK: 08P0113; PACKAGE: SOT-23-5; SUPPLIER: MICROCHIP
U8 = TPS2051B:TPS2051B_D_8; DATASHEETURL: http://www.ti.com/lit/gpn/TPS2051B; DESCRIPTION: Single, Current-Limited, Power-Distribution Switch; FAMILY_NAME: USB POWER SWITCH; GENERIC_PART_NUMBER: TPS2051B; INDUSTRY_STD_PKG_TYPE: SOIC; MANUFACTURER: Texas Instruments; MANUFACTURER_PART_NUMBER: tps2051b_d_8; PACKAGE_DESIGNATOR: D; PIN_COUNT: 8; VENDOR: Texas Instruments
U9 U10 = TPD4S012:TPD4S012_DRY_6; DATASHEETURL: http://www.ti.com/lit/gpn/TPD4S012; DESCRIPTION: 4-Channel USB ESD Solution with Power Clamp; FAMILY_NAME: ESD Solution; GENERIC_PART_NUMBER: TPD4S012; INDUSTRY_STD_PKG_TYPE: SON; MANUFACTURER: Texas Instruments; MANUFACTURER_PART_NUMBER: tpd4s012_dry_6; PACKAGE_DESIGNATOR: DRY; PIN_COUNT: 6; VENDOR: Texas Instruments
U11 = TDA19988BHN:TDA19988BHN
U12 = MT41K256M16HA:MT41K256M16HA
U13 = MTFC4GLDEA0M:MTFC4GLDEA
U14 = LAN8710-EZC:LAN8710A-EZC: IC, MII/RMII 10/100 ENET TRX, 32VQFN; MPN: LAN8710A-EZC; OC_FARNELL: 2292574; OC_NEWARK: 66W1982; PACKAGE: 32VQFN; SUPPLIER: Microchip
U15 = SN74LVC2G241:SN74LVC2G241_DCU_8; DATASHEETURL: http://www.ti.com/lit/gpn/SN74LVC2G241; DESCRIPTION: Dual Buffer/Driver With 3-State Outputs; FAMILY_NAME: LL BUFFER AND DRIVER WITH 3-STATE OUTPUT; GENERIC_PART_NUMBER: SN74LVC2G241; INDUSTRY_STD_PKG_TYPE: US8; MANUFACTURER: Texas Instruments; MANUFACTURER_PART_NUMBER: sn74lvc2g241_dcu_8; PACKAGE_DESIGNATOR: DCU; PIN_COUNT: 8; VENDOR: Texas Instruments
U16 = SN74LVC1G07:SN74LVC1G07_DCK_5; DATASHEETURL: http://www.ti.com/lit/gpn/SN74LVC1G07; DESCRIPTION: Single Buffer/Driver With Open-Drain Output; FAMILY_NAME: LL BUFFER AND DRIVER WITH OPEN-DRAIN OUTPUT; GENERIC_PART_NUMBER: SN74LVC1G07; INDUSTRY_STD_PKG_TYPE: SC70; MANUFACTURER: Texas Instruments; MANUFACTURER_PART_NUMBER: sn74lvc1g07_dck_5; PACKAGE_DESIGNATOR: DCK; PIN_COUNT: 5; VENDOR: Texas Instruments
U$1 = PJ-002A:PJ-002A
U$3 = TPS65217C:TPS65217C
U$4 U$5 = DMC564040R:DMC564040R
Y1 = CM200C-32.768KAZF-UT:CM200C-32.768KAZF-UT
Y2 Y3 = 445C33D24M00000:445C33D24M00000
Y4 = ASDMB-24.576MHZ-LC-T:ASDMB-24.576MHZ-LC-T